# EAGLE design ASD2413 (EAGLE 6.5.0)
DATABASE: ./../../../../../Components/TinyCircuits_Part_Database.txt
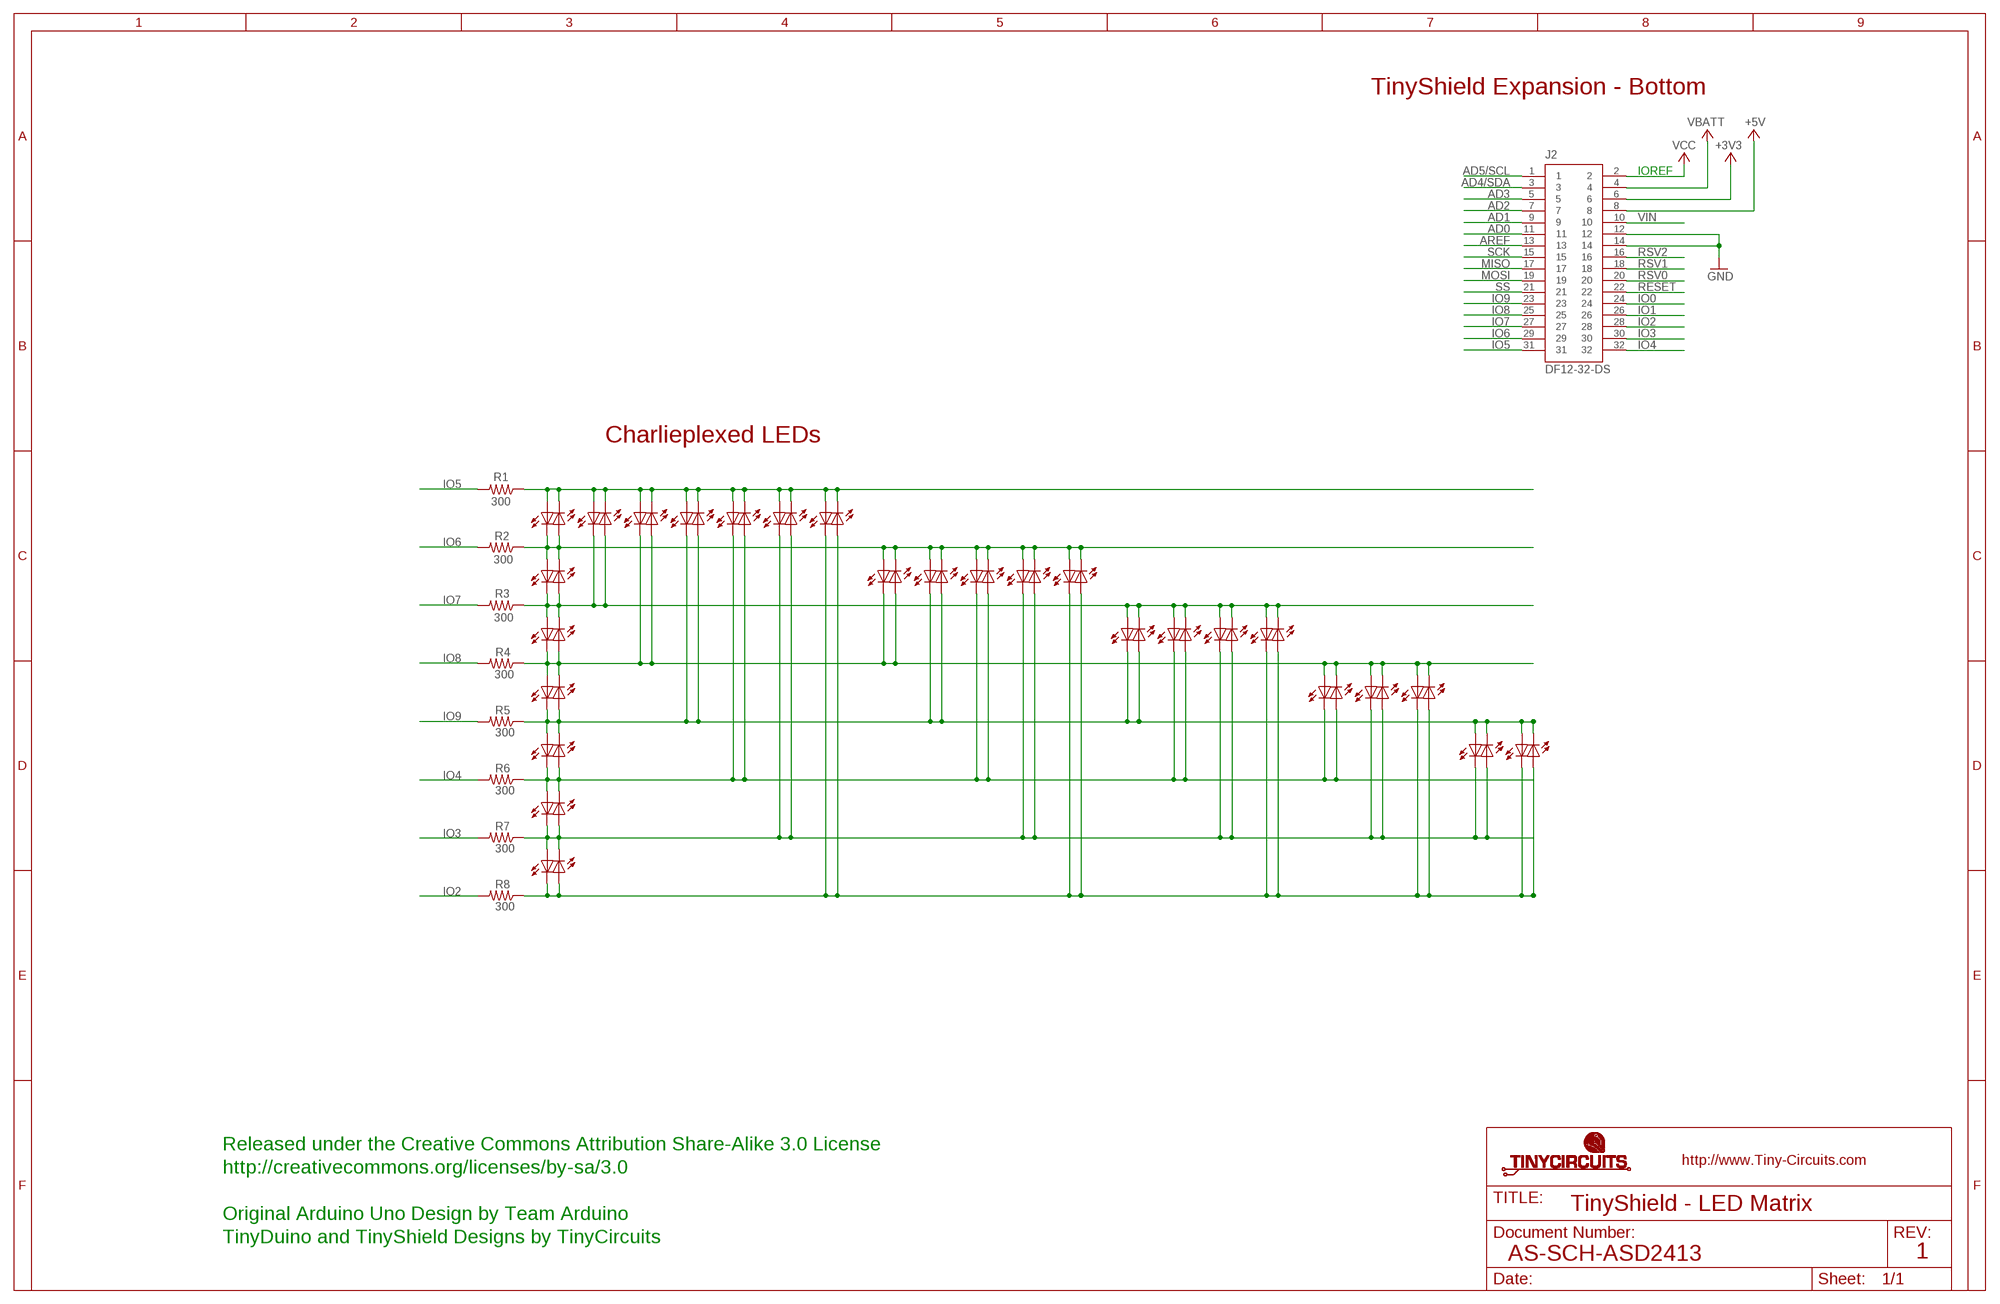
[diagram p0: schematic, sheet 1]

## Parts
D17  GREEN  AS-ITM-00038  [0402_LED]
D18  GREEN  AS-ITM-00038  [0402_LED]
D19  GREEN  AS-ITM-00038  [0402_LED]
D20  GREEN  AS-ITM-00038  [0402_LED]
D21  GREEN  AS-ITM-00038  [0402_LED]
D22  GREEN  AS-ITM-00038  [0402_LED]
D53  GREEN  AS-ITM-00038  [0402_LED]
D54  GREEN  AS-ITM-00038  [0402_LED]
D55  GREEN  AS-ITM-00038  [0402_LED]
D56  GREEN  AS-ITM-00038  [0402_LED]
D57  GREEN  AS-ITM-00038  [0402_LED]
D58  GREEN  AS-ITM-00038  [0402_LED]
D59  GREEN  AS-ITM-00038  [0402_LED]
D60  GREEN  AS-ITM-00038  [0402_LED]
D61  GREEN  AS-ITM-00038  [0402_LED]
D62  GREEN  AS-ITM-00038  [0402_LED]
D63  GREEN  AS-ITM-00038  [0402_LED]
D64  GREEN  AS-ITM-00038  [0402_LED]
D65  GREEN  AS-ITM-00038  [0402_LED]
D66  GREEN  AS-ITM-00038  [0402_LED]
D67  GREEN  AS-ITM-00038  [0402_LED]
D68  GREEN  AS-ITM-00038  [0402_LED]
D69  GREEN  AS-ITM-00038  [0402_LED]
D70  GREEN  AS-ITM-00038  [0402_LED]
D71  GREEN  AS-ITM-00038  [0402_LED]
D72  GREEN  AS-ITM-00038  [0402_LED]
D73  GREEN  AS-ITM-00038  [0402_LED]
D74  GREEN  AS-ITM-00038  [0402_LED]
D75  GREEN  AS-ITM-00038  [0402_LED]
D76  GREEN  AS-ITM-00038  [0402_LED]
D77  GREEN  AS-ITM-00038  [0402_LED]
D78  GREEN  AS-ITM-00038  [0402_LED]
D79  GREEN  AS-ITM-00038  [0402_LED]
D80  GREEN  AS-ITM-00038  [0402_LED]
D81  GREEN  AS-ITM-00038  [0402_LED]
D82  GREEN  AS-ITM-00038  [0402_LED]
D83  GREEN  AS-ITM-00038  [0402_LED]
D84  GREEN  AS-ITM-00038  [0402_LED]
D85  GREEN  AS-ITM-00038  [0402_LED]
D86  GREEN  AS-ITM-00038  [0402_LED]
D87  GREEN  AS-ITM-00038  [0402_LED]
D88  GREEN  AS-ITM-00038  [0402_LED]
D89  GREEN  AS-ITM-00038  [0402_LED]
D90  GREEN  AS-ITM-00038  [0402_LED]
D91  GREEN  AS-ITM-00038  [0402_LED]
D92  GREEN  AS-ITM-00038  [0402_LED]
D93  GREEN  AS-ITM-00038  [0402_LED]
D94  GREEN  AS-ITM-00038  [0402_LED]
D95  GREEN  AS-ITM-00038  [0402_LED]
D96  GREEN  AS-ITM-00038  [0402_LED]
D97  GREEN  AS-ITM-00038  [0402_LED]
D98  GREEN  AS-ITM-00038  [0402_LED]
D99  GREEN  AS-ITM-00038  [0402_LED]
D100  GREEN  AS-ITM-00038  [0402_LED]
J2  DF12-32-DS  AS-ITM-00012  [DF12-32-DS]
R1  300  AS-ITM-00016  [0402]
R2  300  AS-ITM-00016  [0402]
R3  300  AS-ITM-00016  [0402]
R4  300  AS-ITM-00016  [0402]
R5  300  AS-ITM-00016  [0402]
R6  300  AS-ITM-00016  [0402]
R7  300  AS-ITM-00016  [0402]
R8  300  AS-ITM-00016  [0402]

## Nets
+3V3: J2.6
+5V: J2.8
AD0: J2.11
AD1: J2.9
AD2: J2.7
AD3: J2.5
AD4/SDA: J2.3
AD5/SCL: J2.1
AREF: J2.13
GND: J2.12 J2.14
IO0: J2.24
IO1: J2.26
IO2: J2.28 R8.2
IO3: J2.30 R7.2
IO4: J2.32 R6.2
IO5: J2.31 R1.2
IO6: J2.29 R2.2
IO7: J2.27 R3.2
IO8: J2.25 R4.2
IO9: J2.23 R5.2
MISO: J2.17
MOSI: J2.19
N$2: D17.2(C) D18.1(A) D61.1(A) D62.2(C) D63.1(A) D64.2(C) D65.1(A) D66.2(C) D67.1(A) D68.2(C) D69.1(A) D70.2(C) D85.1(A) D86.2(C) R2.1
N$5: D21.2(C) D22.1(A) D73.2(C) D74.1(A) D75.1(A) D76.2(C) D85.2(C) D86.1(A) D91.1(A) D92.2(C) D93.1(A) D94.2(C) D95.1(A) D96.2(C) R4.1
N$6: D55.2(C) D56.1(A) D65.2(C) D66.1(A) D77.2(C) D78.1(A) D79.1(A) D80.2(C) D83.2(C) D84.1(A) D91.2(C) D92.1(A) R6.1
N$7: D59.2(C) D60.1(A) D69.2(C) D70.1(A) D81.2(C) D82.1(A) D89.2(C) D90.1(A) D95.2(C) D96.1(A) D99.2(C) D100.1(A) R8.1
N$11: D17.1(A) D18.2(C) D19.1(A) D20.2(C) D21.1(A) D22.2(C) D53.1(A) D54.2(C) D55.1(A) D56.2(C) D57.1(A) D58.2(C) D59.1(A) D60.2(C) R1.1
N$13: D19.2(C) D20.1(A) D61.2(C) D62.1(A) D71.1(A) D72.2(C) D73.1(A) D74.2(C) D83.1(A) D84.2(C) D87.1(A) D88.2(C) D89.1(A) D90.2(C) R3.1
N$14: D57.2(C) D58.1(A) D67.2(C) D68.1(A) D79.2(C) D80.1(A) D81.1(A) D82.2(C) D87.2(C) D88.1(A) D93.2(C) D94.1(A) D97.2(C) D98.1(A) R7.1
N$15: D53.2(C) D54.1(A) D63.2(C) D64.1(A) D71.2(C) D72.1(A) D75.2(C) D76.1(A) D77.1(A) D78.2(C) D97.1(A) D98.2(C) D99.1(A) D100.2(C) R5.1
RESET: J2.22
RSV0: J2.20
RSV1: J2.18
RSV2: J2.16
SCK: J2.15
SS: J2.21
VBATT: J2.4
VCC: J2.2
VIN: J2.10

## Notes on the sheet
- TinyShield Expansion - Bottom
- IOREF
- Charlieplexed LEDs
- Released under the Creative Commons Attribution Share-Alike 3.0 License
- http://creativecommons.org/licenses/by-sa/3.0
- TinyShield - LED Matrix
- Original Arduino Uno Design by Team Arduino
- TinyDuino and TinyShield Designs by TinyCircuits
- AS-SCH-ASD2413 | 1

## Library data of the parts
D17-D22 D53-D100 = tinycircuits:AS-ITM-00038: LED 0402 GREEN WTR CLR SMD; PARTNO: AS-ITM-00038
J2 = tinycircuits:AS-ITM-00012: CONN RECEPT 32POS 3MM SMD 0.5MM; PARTNO: AS-ITM-00012
R1-R8 = tinycircuits:AS-ITM-00016: RES 300 OHM 1/16W 1% 0402; PARTNO: AS-ITM-00016

## Board
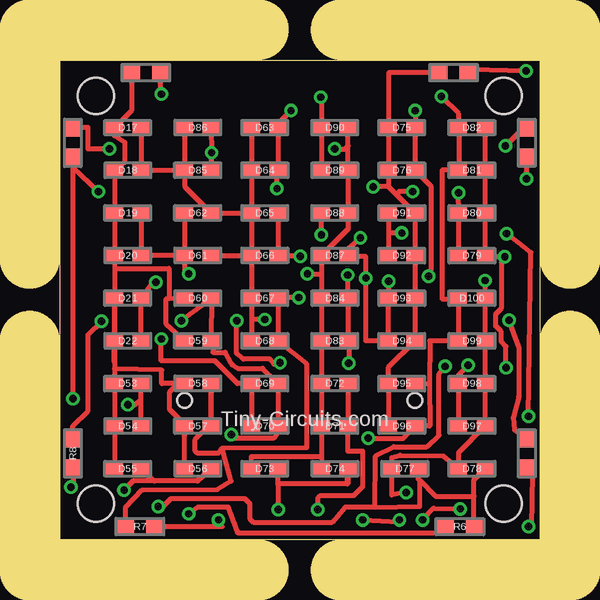
[diagram p1: board, top side]
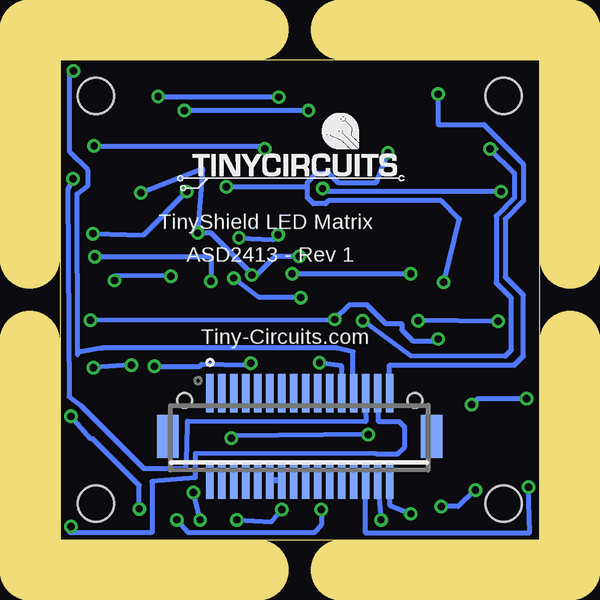
[diagram p2: board, bottom side, seen from below]

Size 20 x 20 mm. Coordinates in mm from the lower left corner, seen from the top.
Outline: 0,20 20,20 20,0 0,0 0,20
Copper layers (1*16): Top 0.035mm / dielectric 1.5mm / Bottom 0.035mm
Design rules "default *": minimum track width 8mil, minimum drill 12mil, track to track 6mil, track to pad 6mil, pad to pad 6mil, via to via 6mil, smd to smd 6mil, copper to edge 6mil, drill to drill 8mil, minimum pad ring 10mil, minimum via ring 5mil, stop-mask expansion 4mil, vias tented up to drill 25mil, thermal gap 10mil
Holes 1.5 mm at 1.5,18.5 18.5,18.5 18.5,1.5 1.5,1.5
Milling: 8 lines

### Footprints (pad centres in the part's own frame; a part is rotated, then mirrored left to right if it is on the bottom)
0402_LED = smd 0.7 x 0.5: 1 -0.55,0; 2 0.55,0
DF12-32-DS = smd 0.3 x 1.6: 1 -3.75,1.8; 2 -3.75,-1.8; 3 -3.25,1.8; 4 -3.25,-1.8; 5 -2.75,1.8; 6 -2.75,-1.8; 7 -2.25,1.8; 8 -2.25,-1.8; 9 -1.75,1.8; 10 -1.75,-1.8; 11 -1.25,1.8; 12 -1.25,-1.8; 13 -0.75,1.8; 14 -0.75,-1.8; 15 -0.25,1.8; 16 -0.25,-1.8; 17 0.25,1.8; 18 0.25,-1.8; 19 0.75,1.8; 20 0.75,-1.8; 21 1.25,1.8; 22 1.25,-1.8; 23 1.75,1.8; 24 1.75,-1.8; 25 2.25,1.8; 26 2.25,-1.8; 27 2.75,1.8; 28 2.75,-1.8; 29 3.25,1.8; 30 3.25,-1.8; 31 3.75,1.8; 32 3.75,-1.8 | smd 0.9 x 1.8: F1 -5.5,0; F2 5.5,0 | hole 0.6: -4.8,1.5; 4.8,1.5
0402 = smd 0.7 x 0.6: 1 -0.6,0; 2 0.6,0

### Placement (x,y rotation side)
D17  2.83,17.18 0 top
D18  2.83,15.4 180 top
D19  2.83,13.62 0 top
D20  2.83,11.84 180 top
D21  2.83,10.07 0 top
D22  2.83,8.29 180 top
D53  2.83,6.51 0 top
D54  2.83,4.73 180 top
D55  2.83,2.95 0 top
D56  5.75,2.95 180 top
D57  5.75,4.73 0 top
D58  5.75,6.51 180 top
D59  5.75,8.29 0 top
D60  5.75,10.07 180 top
D61  5.75,11.84 180 top
D62  5.75,13.62 0 top
D63  8.54,17.18 0 top
D64  8.54,15.4 180 top
D65  8.54,13.62 0 top
D66  8.54,11.84 180 top
D67  8.54,10.07 0 top
D68  8.54,8.29 180 top
D69  8.54,6.51 0 top
D70  8.54,4.73 180 top
D71  11.46,4.73 0 top
D72  11.46,6.51 180 top
D73  8.54,2.95 0 top
D74  11.46,2.95 180 top
D75  14.26,17.18 0 top
D76  14.26,15.4 180 top
D77  14.38,2.95 0 top
D78  17.18,2.95 180 top
D79  17.18,11.84 0 top
D80  17.18,13.62 180 top
D81  17.18,15.4 180 top
D82  17.18,17.18 0 top
D83  11.46,8.29 0 top
D84  11.46,10.07 180 top
D85  5.75,15.4 0 top
D86  5.75,17.18 180 top
D87  11.46,11.84 0 top
D88  11.46,13.62 0 top
D89  11.46,15.4 180 top
D90  11.46,17.18 0 top
D91  14.26,13.62 180 top
D92  14.26,11.84 0 top
D93  14.26,10.07 180 top
D94  14.26,8.29 0 top
D95  14.26,6.51 0 top
D96  14.26,4.73 180 top
D97  17.18,4.73 180 top
D98  17.18,6.51 0 top
D99  17.18,8.29 180 top
D100  17.18,10.07 0 top
J2  10,4.3 0 bottom
R1  3.59,19.46 0 top
R2  19.46,3.59 270 top
R3  19.46,16.54 270 top
R4  16.42,19.46 0 top
R5  0.54,16.54 90 top
R6  16.67,0.54 180 top
R7  3.34,0.54 0 top
R8  0.54,3.59 270 top
U$1  [DOCFIELD-TINYCIRCUITS-PCB]  33.91,-10 0 top  (outside the outline)

### Tracks (layer width: path | path; a pad name or v marks a point on that pad's centre or on a via)
+3V3
  Bottom 0.254: 12.74,2.51 J2.6
GND
  Bottom 0.254: J2.12 J2.14
IO2  (via drill 0.3)
  Top 0.203: v0.46,2.19 0.59,2.22 R8.2
  Bottom 0.203: J2.28 7.27,2.5 7.27,0.29 0.41,0.29 v0.46,2.19
IO3  (via drill 0.3)
  Top 0.203: v6.61,0.82 6.76,0.54 R7.2
  Bottom 0.203: J2.30 6.76,2.5 v6.61,0.82
IO4  (via drill 0.3)
  Top 0.203: 5.39,1.07 v5.37,1.07 5.75,1.35 7.02,1.35 7.4,0.29 16.07,0.29 R6.2
  Bottom 0.203: 6.21,3.14 6.26,3.14 6.26,1.43 v5.37,1.07
  Bottom 0.254: 6.21,3.14 6.26,3.1 J2.32
IO5  (via drill 0.3)
  Top 0.203: v4.22,18.57 4.19,18.57 R1.2
  Bottom 0.203: J2.31 6.26,7.27 1.05,7.27 0.67,7.65 0.67,10.19 1.43,10.95 1.43,13.37 0.67,14.13 0.67,15.65 2.32,17.3 4.22,17.3 v4.22,18.57
IO6  (via drill 0.3)
  Top 0.203: v19.54,0.54 19.67,0.54 19.72,2.73 R2.2
  Bottom 0.203: 6.76,6.1 J2.29 6.71,6.06 6.71,4.91 5.85,4.91 5.62,4.68 5.62,3.87 5.93,3.56 6.79,3.56 14.36,3.59 14.36,2.57 16.16,2.42 16.16,0.29 19.59,0.29 v19.54,0.54
IO7  (via drill 0.3)
  Top 0.203: v19.46,15.04 R3.2
  Bottom 0.203: J2.27 7.27,6.1 7.25,4.91 14.69,4.94 14.71,3.84 14.77,3.01 14.89,2.95 16.49,2.95 19.11,5.57 19.62,5.95 19.67,14.59 v19.46,15.04
IO8  (via drill 0.3)
  Top 0.203: v19.44,19.54 17.14,19.59 R4.2
  Bottom 0.203: J2.25 7.78,6.1 7.78,7.83 8.47,7.98 18.25,7.98 19.26,7.8 | 19.26,7.7 19.26,7.8 | 19.26,7.8 19.29,14.41 18.83,14.77 18.83,15.4 19.59,16.16 19.59,19.46 v19.44,19.54
IO9  (via drill 0.3)
  Top 0.203: v2.06,16.29 1.18,16.29 1.18,17.18 0.54,17.18 R5.2 | v9.18,7.37 8.92,7.32 8.77,7.53 7.65,7.53 7.37,7.75 v7.37,9.13
  Bottom 0.203: J2.23 8.25,7.23 v9.18,7.37 | v7.37,9.13 5.39,7.68 1.43,7.65 1.18,7.91 1.18,10.07 1.81,10.7 1.81,13.5 1.05,14.26 1.05,15.27 v2.06,16.29 1.81,16.29
N$2  (via drill 0.3)
  Top 0.203: D17.2 D18.1 D85.1 | D86.2 D85.1 | D85.1 5.2,14.72 D62.2 D65.1 | D63.1 D64.2 D65.1 | D65.1 D66.2 | D66.2 D67.1 7.99,9.18 | 7.99,9.18 D68.2 | D70.2 D69.1 7.4,6.51 6.46,7.45 4.22,7.45 v4.22,8.36 | v18.73,9.15 19.13,8.03 19.13,5.95 18.91,5.09 18.96,4.57 R2.1 | v8.54,9.18 7.99,9.18 | D61.1 D66.2
  Bottom 0.203: v18.73,9.15 v8.54,9.18 7.93,9.79 7.2,9.79 6.41,9 5.75,9 5.75,8.75 5.29,8.29 4.3,8.29 v4.22,8.36 4.35,8.36 4.35,8.52
N$5  (via drill 0.3)
  Top 0.203: D22.1 D21.2 3.94,10.81 v3.99,10.73 | D86.1 v6.32,16.14 6.3,16.14 D85.2 | 11.97,2.32 11.97,2.95 D74.1 12.01,2.36 11.97,2.32 | 9.13,2.32 9.09,2.32 D73.2 | 13.71,14.72 D76.2 D75.1 13.71,19.46 R4.1 | 13.71,14.72 14.04,14.39 | 14.04,14.39 D91.1 D92.2 D93.1 D94.2 13.71,7.19 D95.1 D96.2 | 13.71,14.72 13.06,14.72 v13.06,14.71 | 11.97,2.32 9.13,2.32 | 9.13,2.32 9.1,2.34 v9.1,1.25 | v15.12,0.82 15.15,0.87 15.58,1.3 v16.7,1.28 | v19.54,5.14 19.64,11.97 v18.63,12.76 | v14.71,14.51 14.16,14.51 14.04,14.39
  Bottom 0.203: v3.99,10.73 3.34,13.37 4.1,14.13 8.8,14.13 8.92,14 9.43,14 9.68,14.26 9.68,14.71 | 9.68,14.71 9.68,14.89 9.3,15.27 8.8,15.27 8.41,14.89 6.81,14.89 v6.32,16.14 | v13.06,14.71 9.68,14.71 | v9.1,1.25 9.1,0.62 9.41,0.29 14.64,0.29 v15.12,0.82 | v16.7,1.28 16.7,2.27 18.63,4.2 18.73,4.2 v19.54,5.14 | v18.63,12.76 16.52,12.71 v14.71,14.51
N$6  (via drill 0.3)
  Top 0.203: D65.2 D66.1 9.12,11.82 v10.02,11.82 | D91.2 13.71,12.78 | 13.71,12.78 D92.1 | R6.1 17.27,1.81 | 17.27,1.81 17.27,2.5 D78.1 | D77.2 14.93,2.53 15.01,2.46 | 15.01,2.46 15.65,1.81 17.27,1.81 | D55.2 3.94,2.45 | 5.74,2.45 D56.1 5.75,2.45 5.74,2.45 | D79.1 D80.2 16.64,13.62 v16.62,14.46 | v14.26,12.78 13.71,12.78 | v12.05,7.35 12.05,8.29 D83.2 D84.1 12.01,11.02 v12,11.03 | 13.14,1.35 15.01,1.38 15.01,2.46 | 13.14,1.35 13.16,3.49 13.93,3.87 15.3,3.87 15.81,4.35 15.81,6.92 v16.06,7.22 | 5.74,2.45 3.94,2.45 | 3.94,2.45 3.06,2.45 v2.68,2.06 | v4.1,1.38 4.3,1.38 4.63,1.71 7.7,1.71 7.91,1.51 7.91,0.87 8.06,0.72 11.36,0.72 11.89,1.35 13.14,1.35
  Bottom 0.203: v16.62,14.46 14.05,15.48 v14.26,12.78 13.71,12.78 12,11.07 | v12,11.03 12,11.07 | 12,11.07 11.75,11.07 11.01,11.82 v10.02,11.82 | v16.06,7.22 14.18,7.22 14.08,7.32 12.25,7.27 v12.05,7.35 | v2.68,2.06 2.72,2.04 3.39,1.38 v4.1,1.38
N$7  (via drill 0.3)
  Top 0.203: D60.1 6.32,10.17 | 6.32,10.17 D59.2 6.38,8.29 6.38,7.8 6.89,7.8 7.14,7.35 7.2,7.27 7.4,7.14 8.46,7.14 D69.2 D70.1 9.09,4.47 8.92,4.22 7.17,4.22 v7.14,4.38 | D89.2 D90.1 10.91,18.45 v10.88,18.45 | D95.2 15.4,6.51 | 15.4,6.51 15.43,4.73 D96.1 14.32,4.22 v12.86,4.22 | R8.1 0.54,4.73 1.18,5.37 1.18,8.54 v1.73,9.1 | v5.06,9.13 5.94,9.79 6.32,10.17 | v15.91,18.47 16.63,17.75 D82.1 D81.2 15.93,15.4 15.93,10.04 16.63,10.04 D100.1 D99.2 15.43,8.29 15.4,6.51
  Bottom 0.203: v1.73,9.1 v5.06,9.13 | v15.91,18.47 10.88,18.47 v10.88,18.45 | v7.14,4.38 12.78,4.33 v12.86,4.22
N$11
  Top 0.203: 2.28,7.44 2.28,7.12 | 2.28,7.12 D53.1 D54.2 D55.1 | 2.28,7.44 D22.2 D21.1 D20.2 D19.1 D18.2 2.7,15.72 2.7,16.57 2.28,16.84 D17.1 2.99,17.89 R1.1 | 2.28,7.44 2.27,7.4 2.27,7.45 2.29,11.31 4.54,11.31 4.54,10.04 | D56.2 D57.1 5.2,4.8 4.58,5.42 4.58,6.15 4.94,6.51 D58.2 4.25,6.51 4.25,7.07 2.28,7.12 | D59.1 4.43,8.97 4.43,10.04 4.54,10.04 | 4.54,10.04 D60.2
N$13  (via drill 0.3)
  Top 0.203: D19.2 D20.1 D61.2 | D62.1 D61.2 | 12.01,16.42 D89.1 D88.2 12.01,12.94 D87.1 10.91,11.08 | 12.01,16.42 D90.2 | 10.91,11.08 D84.2 D83.1 D72.2 D71.1 10.91,3.46 | 10.91,3.46 D74.2 | R3.1 19.3,17.14 v18.57,16.42 | v11.46,16.29 11.89,16.29 12.01,16.42 | D61.2 5.2,11.25 v5.37,11.08 | v10.32,11.08 10.91,11.08 | D73.1 7.98,3.46 10.91,3.46
  Bottom 0.203: v18.57,16.42 11.59,16.42 v11.46,16.29 | v5.37,11.08 v10.32,11.08
N$14  (via drill 0.3)
  Top 0.203: v13.71,10.78 D93.2 D94.1 12.76,8.29 v12.76,10.9 12.76,11.79 12.01,11.79 D87.2 12.01,12.14 v12.53,12.58 | D82.2 D81.1 D80.1 D79.2 17.78,11.79 v18.55,11.79 18.42,11.67 18.42,9.66 18.17,9.41 18.17,8.9 18.4,8.67 18.4,8.26 18.6,8.06 v18.6,7.17 | D97.2 D98.1 16.63,6.87 v17.03,7.27 | R7.1 2.73,1.34 3.44,2.06 6.56,2.09 7.14,2.45 6.76,3.82 | 6.76,3.82 6.76,3.78 | D57.2 D58.1 6.3,4.71 6.19,4.71 5.62,4.15 5.62,3.72 5.72,3.61 6.61,3.61 6.76,3.82 | 6.76,3.82 10.3,3.84 10.3,7.31 D68.1 D67.2 9.09,10.09 v9.96,10.09 | v10.9,12.71 D88.1
  Bottom 0.203: v18.55,11.79 13.71,11.79 v13.71,10.78 | v12.76,10.9 11.72,10.12 9.96,10.12 v9.96,10.09 | v12.53,12.58 11.11,12.5 v10.9,12.71 | v17.03,7.27 v18.6,7.17
N$15  (via drill 0.3)
  Top 0.203: D54.1 3.38,5.88 | 3.38,5.88 D53.2 | D72.1 D71.2 12,4.73 12,3.69 12.63,3.69 12.63,2.22 12.25,1.84 10.85,1.84 10.75,1.73 v10.75,1.25 | v0.54,5.88 R5.1 0.54,15.53 v1.61,14.51 | v2.83,5.62 3.12,5.62 3.38,5.88 | D77.1 13.79,2.95 | D77.1 13.83,3.42 14.18,3.51 15.99,3.49 D78.2 16.63,3.63 D97.1 D98.2 D99.1 D100.2 v17.73,10.8 | v9.05,14.64 9.05,15.36 D64.1 D63.2 9.09,17.35 v9.63,17.89 | v14.82,17.89 D75.2 D76.1 15.48,14.73 15.48,11.26 15.27,11.06 v15.38,10.98 | v12.63,0.82 14.13,0.74 v14.16,0.82 | v14.43,1.96 13.83,1.86 D77.1
  Bottom 0.203: v0.54,5.88 2.57,5.88 v2.83,5.62 | v1.61,14.51 8.92,14.51 v9.05,14.64 | v9.63,17.89 v14.82,17.89 | v15.38,10.98 15.35,10.98 17.66,11.01 17.73,10.94 v17.73,10.8 | v14.16,0.82 v14.43,1.96 | v12.63,0.82 11.18,0.74 v10.75,1.25

### Text on the board
tPlace: Tiny-Circuits.com
bPlace: TinyShield LED Matrix | ASD2413 - Rev 1 | Tiny-Circuits.com
Document: FABRICATION DRAWING | NOTES: | 1. PRINTED CIRCUIT BOARD MADE FROM NEMA GRADE FR-4 EPOXY LAMINATE | WITH 1 OUNCE COPPER PLATING AND .024 THICKNESS. | 2. ALL DIMENSIONS ARE GIVEN IN INCHES. | 3. CIRCUIT PATHS ARE FOR REFERENCE ONLY. | 4. HOLE SIZES SHOWN ARE FINISHED DIAMETERS AFTER PLATING. | 5. BOARD PLATED USING REFLOW OR SIMILAR METHOD. | 6. BOARD TO HAVE GREEN SOLDER MASK ON PLATED SURFACES USING WET FILM | 7. SILKSCREEN BOARD USING WHITE INK. | SR100 OR SR1010 EPOXY. EQUIVALENT WET OR DRY FILM MAY BE USED. | 8. THE FOLLOWING INFORMATION APPLIES TO THIS BOARD: | * 2 COPPER LAYERS | * .024 BOARD THICKNESS | * REQUIRES TOP SIDE SILKSCREEN | TinyShield - LED Matrix | AS-PCB-ASD2413 | 1